# EAGLE design hestiapiUS (EAGLE 9.4.2)
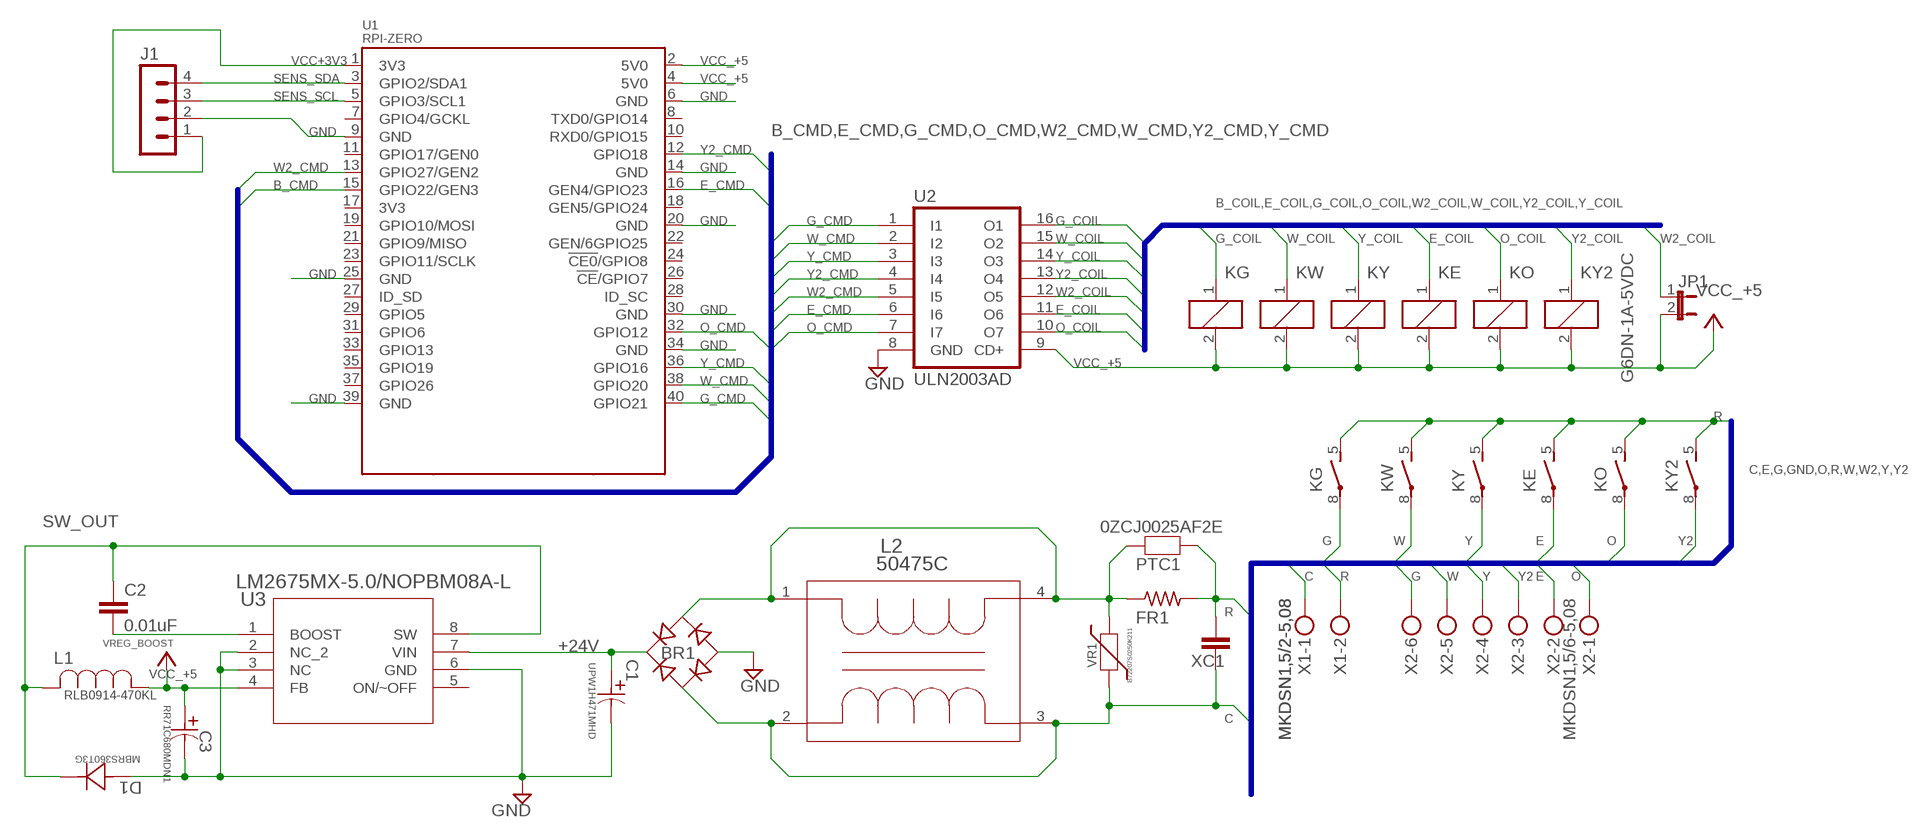
[diagram p0: schematic, sheet 1]

## Parts
BR1  DF06S  [DFS]
C1  UPW1H471MHD  [PCAP_12_5X20-THRU-ELECT]
C2  0.01uF  0.01UF-0603-25V-(+80/-20%)  [0603]
C3  RR71C680MDN1  [RR-A]
D1  MBRS360T3G  [DIODE_SMC_7P15X6P25]
FR1  R-US_0207/12  [0207/12]
J1  MA04-1  [MA04-1]
JP1  JP1E  [JP1]
KE  G6DN-1A-5VDC  [G6DN]
KG  G6DN-1A-5VDC  [G6DN]
KO  G6DN-1A-5VDC  [G6DN]
KW  G6DN-1A-5VDC  [G6DN]
KY  G6DN-1A-5VDC  [G6DN]
KY2  G6DN-1A-5VDC  [G6DN]
L1  RLB0914-470KL  [IND_BOURNS_RLB0914]
L2  50475C  [IND_50XXXC]
PTC1  0ZCJ0025AF2E  [0ZCJ]
U1  RPI-ZERO  [RASPBERRYPI_BASTELSTUBE_V13_RASPI_BOARD_B+_FULL]
U2  ULN2003AD  [SO16]
U3  LM2675MX-5.0/NOPBM08A-L  [M08A-L]
VR1  B72207S0250K211  [VARISTOR7MM]
X1  MKDSN1,5/2-5,08  [MKDSN1,5/2-5,08]
X2  MKDSN1,5/6-5,08  [MKDSN1,5/6-5,08]
XC1  C-EU025-024X044  [C025-024X044]

## Nets
+24_FUSED: BR1.AC2 FR1.1 L2.1 L2.4 PTC1.1 VR1.2
+24V: BR1.+ C1.1 U3.7(VIN)
B_CMD: U1.15(GPIO22/GEN3)
C: BR1.AC1 L2.2 L2.3 VR1.1 X1.1 XC1.2
E: KE.8(2:P) X2.2
E_CMD: U1.16(GEN4/GPIO23) U2.6(I6)
E_COIL: KE.1 U2.11(O6)
G: KG.8(2:P) X2.6
G_CMD: U1.40(GPIO21) U2.1(I1)
G_COIL: KG.1 U2.16(O1)
GND: BR1.- C1.2 C3.2 D1.2 J1.2 U1.6(GND) U1.9(GND) U1.14(GND) U1.20(GND) U1.25(GND) U1.30(GND) U1.34(GND) U1.39(GND) U2.8(GND) U3.2(NC_2) U3.3(NC) U3.6(GND)
O: KO.8(2:P) X2.1
O_CMD: U1.32(GPIO12) U2.7(I7)
O_COIL: KO.1 U2.10(O7)
R: FR1.2 KE.5(2:S) KG.5(2:S) KO.5(2:S) KW.5(2:S) KY2.5(2:S) KY.5(2:S) PTC1.2 X1.2 XC1.1
SENS_SCL: J1.3 U1.5(GPIO3/SCL1)
SENS_SDA: J1.4 U1.3(GPIO2/SDA1)
SW_OUT: C2.1 D1.1 L1.2 U3.8(SW)
VCC+3V3: J1.1 U1.1(3V3)
VCC_+5: C3.1 JP1.2 KE.2 KG.2 KO.2 KW.2 KY2.2 KY.2 L1.1 U1.2(5V0) U1.4(5V0) U2.9(CD+) U3.4(FB) ; supply symbol labelled VCC
VREG_BOOST: C2.2 U3.1(BOOST)
W: KW.8(2:P) X2.5
W2_CMD: U1.13(GPIO27/GEN2) U2.5(I5)
W2_COIL: JP1.1 U2.12(O5)
W_CMD: U1.38(GPIO20) U2.2(I2)
W_COIL: KW.1 U2.15(O2)
Y: KY.8(2:P) X2.4
Y2: KY2.8(2:P) X2.3
Y2_CMD: U1.12(GPIO18) U2.4(I4)
Y2_COIL: KY2.1 U2.13(O4)
Y_CMD: U1.36(GPIO16) U2.3(I3)
Y_COIL: KY.1 U2.14(O3)
Unconnected: U1.7(GPIO4/GCKL) U1.8(TXD0/GPIO14) U1.10(RXD0/GPIO15) U1.11(GPIO17/GEN0) U1.17(3V3) U1.18(GEN5/GPIO24) U1.19(GPIO10/MOSI) U1.21(GPIO9/MISO) U1.22(GEN/6GPIO25) U1.23(GPIO11/SCLK) U1.24(!CE0!/GPIO8) U1.26(!CE!/GPIO7) U1.27(ID_SD) U1.28(ID_SC) U1.29(GPIO5) U1.31(GPIO6) U1.33(GPIO13) U1.35(GPIO19) U1.37(GPIO26) U3.5(ON/~OFF)

## Buses
B_CMD,E_CMD,G_CMD,O_CMD,W2_CMD,W_CMD,Y2_CMD,Y_CMD
B_COIL,E_COIL,G_COIL,O_COIL,W2_COIL,W_COIL,Y2_COIL,Y_COIL
C,E,G,GND,O,R,W,W2,Y,Y2

## Library data of the parts
BR1 = hestiapiUS:DF*S: Surface Mount Glass Passivated Bridge Rectifiers Source: Source: Comchip Bridge Rectifiers DF005S-G thru DF10S-G.pdf
C1 = hestiapiUS:UPW1H471MHD; MANUFACTURER_PART_NUMBER: UPW1H471MHD; VENDOR: Nichicon
C2 = hestiapiUS:0.01UF: 0.1µF ceramic capacitors A capacitor is a passive two-terminal electrical component used to store electrical energy temporarily in an electric field.; PROD_ID: CAP-00810
C3 = hestiapiUS:RR71C680MDN1; MANUFACTURER_PART_NUMBER: RR71C680MDN1; VENDOR: Nichicon
D1 = hestiapiUS:MBRS360T3G; MANUFACTURER_PART_NUMBER: MBRS360T3G; VENDOR: ON Semiconductor
FR1 = rcl:R-US_: RESISTOR, American symbol; SPICEPREFIX: R
J1 = hestiapiUS:MA04-1: PIN HEADER; OC_FARNELL: unknown; OC_NEWARK: unknown
JP1 = hestiapiUS:JP1E: JUMPER
KE KG KO KW KY KY2 = hestiapiUS:G6DN?*: OMRON Slim, Miniature PCB Relay 20 × 5.08 × 12.5 mm Source: https://omronfs.omron.com/en_US/ecb/products/pdf/en-g6dn.pdf; OC_FARNELL: 9812660; OC_NEWARK: unknown
L1 = hestiapiUS:RLB0914-470KL; MANUFACTURER_PART_NUMBER: RLB0914470KL; VENDOR: Bourns Electronics
L2 = hestiapiUS:50475C; MANUFACTURER_PART_NUMBER: 50475C; VENDOR: Murata
PTC1 = hestiapiUS:0ZCJ0025AF2E; MANUFACTURER_PART_NUMBER: 0ZCJ0025AF2E; VENDOR: Belfuse
U1 = hestiapiUS:RPI-ZERO
U2 = hestiapiUS:ULN2003A: DRIVER ARRAY
U3 = hestiapiUS:LM2675MX-5.0/NOPB; MANUFACTURER_PART_NUMBER: LM2675MX5.0NOPB; VENDOR: Texas Instruments
VR1 = hestiapiUS:B72207S0250K211: VARISTOR 39V 250A DISC 7MM Datasheet: B72207S0250K211 <https://product.tdk.com/info/en/documents/data_sheet/70/db/var/SIOV_Leaded_StandarD.pdf>
X1 = hestiapiUS:MKDSN1,5/2-5,08: MKDSN 1,5/ 2-5,08 Printklemme Nennstrom: 13,5 A Nennspannung: 250 V Rastermaß: 5,08 mm Polzahl: 2 Anschlussart: Schraubanschluss Montage: Löten Anschlussrichtung Leiter/Platine: 0 ° Artikelnummer: 1729128 Source: http://eshop.phoenixcontact.com .. 1729128.pdf
X2 = hestiapiUS:MKDSN1,5/6-5,08: MKDSN 1,5/ 6-5,08 Printklemme Nennstrom: 13,5 A Nennspannung: 250 V Rastermaß: 5,08 mm Polzahl: 6 Anschlussart: Schraubanschluss Montage: Löten Anschlussrichtung Leiter/Platine: 0 ° Artikelnummer: 1729160 Source: http://eshop.phoenixcontact.com .. 1729160.pdf
XC1 = rcl:C-EU: CAPACITOR, European symbol; SPICEPREFIX: C

## Board
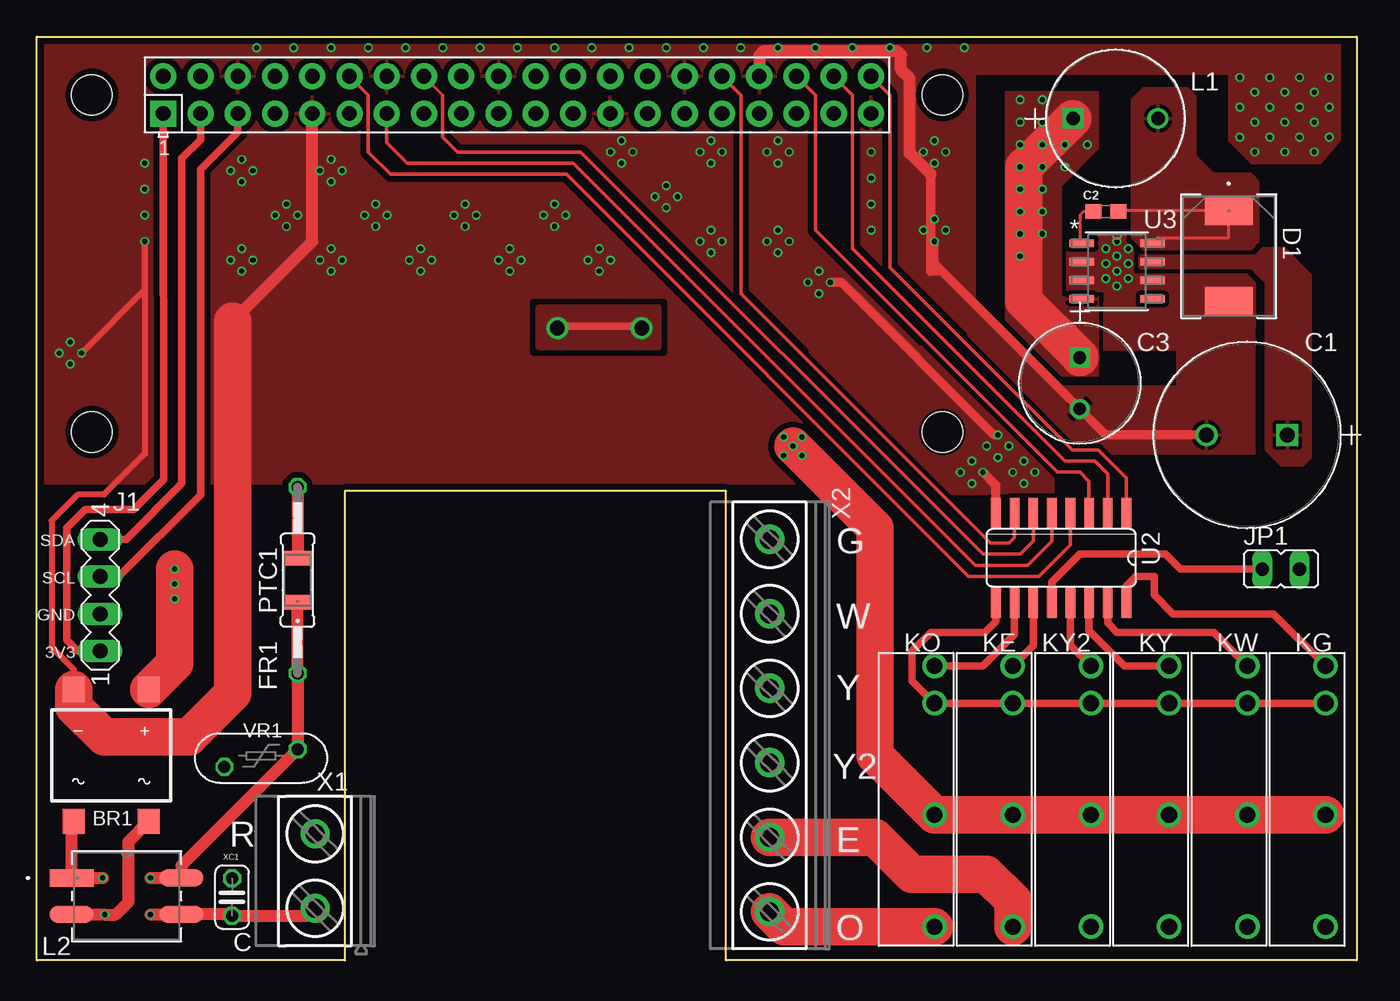
[diagram p1: board, top side]
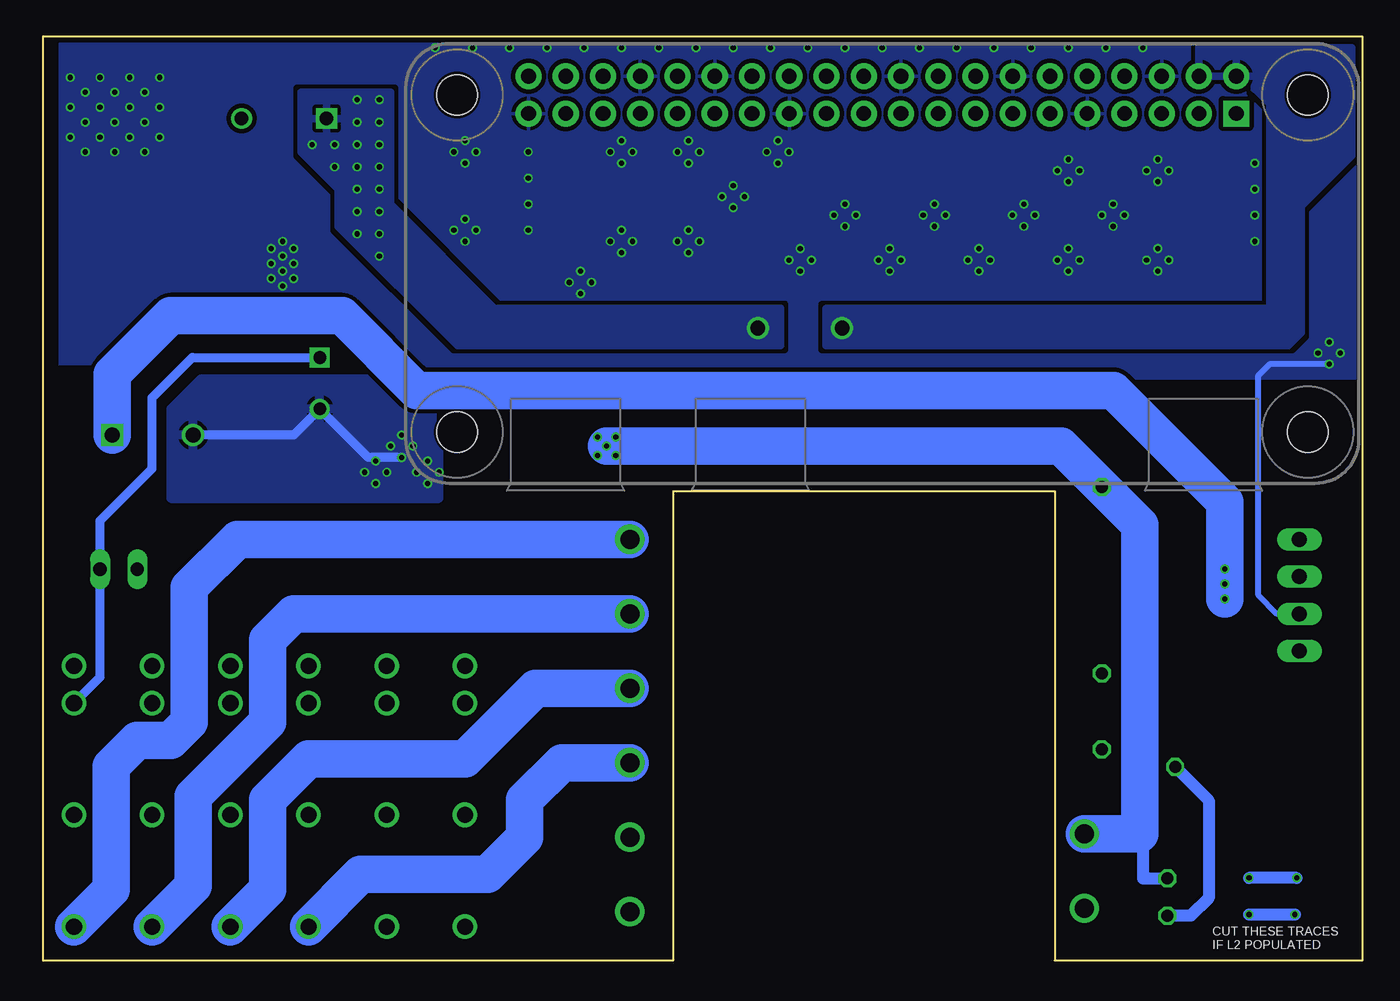
[diagram p2: board, bottom side, seen from below]

Size 90 x 63 mm. Coordinates in mm from the lower left corner, seen from the top.
Outline: 0,63 90,63 90,0 47,0 47,32 21,32 21,0 0,0 0,63
Copper layers (1*16): Top 0.035mm / dielectric 1.5mm / Bottom 0.035mm
Design rules "hestiapi": minimum track width 8mil, minimum drill 0.3mm, track to track 12mil, track to pad 10mil, pad to pad 12mil, via to via 12mil, smd to smd 6mil, copper to edge 0.2mm, drill to drill 10mil, minimum pad ring 6mil, minimum via ring 5mil, stop-mask expansion 4mil, vias tented up to drill 0mil, thermal gap 10mil

### Footprints (pad centres in the part's own frame; a part is rotated, then mirrored left to right if it is on the bottom)
DFS = smd 1.5 x 1.7: + -2.55,-4.5; - 2.55,-4.5; AC1 -2.55,4.5; AC2 2.55,4.5
PCAP_12_5X20-THRU-ELECT = drill 1.016 pad 1.524 square: 1 -5.512,0 | drill 1.016 pad 1.524: 2 0,0
0603 = smd 1.1 x 1: 1 -0.85,0; 2 0.85,0
RR-A = drill 0.864 pad 1.372 square: 1 -3.505,0 | drill 0.864 pad 1.372: 2 0,0
DIODE_SMC_7P15X6P25 = smd 1.956 x 3.251: 1 -3.099,0; 2 3.099,0
0207/12 = drill 0.813 octagon: 1 -6.35,0; 2 6.35,0
MA04-1 = drill 1.016 long: 1 -3.81,0; 2 -1.27,0; 3 1.27,0; 4 3.81,0
JP1 = drill 0.914 long: 1 0,-1.27; 2 0,1.27
G6DN = drill 1.1 pad 1.676: 1 -9.144,1.27; 2 -6.604,1.27; 5 1.016,1.27; 8 8.636,1.27
IND_BOURNS_RLB0914 = drill 0.914 pad 1.422 square: 1 -5.791,0 | drill 0.914 pad 1.422: 2 0,0
IND_50XXXC = smd 2.997 x 1.194: 1 -3.747,1.245; 2 -3.747,-1.245; 3 3.747,-1.245; 4 3.747,1.245
0ZCJ = smd 0.991 x 1.905: 1 -1.499,0; 2 1.499,0
RASPBERRYPI_BASTELSTUBE_V13_RASPI_BOARD_B+_FULL = drill 1 pad 1.778 square: 1 8.37,25.23 | drill 1 pad 1.778: 2 8.37,27.77; 3 10.91,25.23; 4 10.91,27.77; 5 13.45,25.23; 6 13.45,27.77; 7 15.99,25.23; 8 15.99,27.77; 9 18.53,25.23; 10 18.53,27.77; 11 21.07,25.23; 12 21.07,27.77; 13 23.61,25.23; 14 23.61,27.77; 15 26.15,25.23; 16 26.15,27.77; 17 28.69,25.23; 18 28.69,27.77; 19 31.23,25.23; 20 31.23,27.77; 21 33.77,25.23; 22 33.77,27.77; 23 36.31,25.23; 24 36.31,27.77; 25 38.85,25.23; 26 38.85,27.77; 27 41.39,25.23; 28 41.39,27.77; 29 43.93,25.23; 30 43.93,27.77; 31 46.47,25.23; 32 46.47,27.77; 33 49.01,25.23; 34 49.01,27.77; 35 51.55,25.23; 36 51.55,27.77; 37 54.09,25.23; 38 54.09,27.77; 39 56.63,25.23; 40 56.63,27.77 | hole 2.75: 3.5,3.5; 3.5,26.5; 61.5,3.5; 61.5,26.5
SO16 = smd 0.66 x 2.032: 1 -4.445,-3.073; 2 -3.175,-3.073; 3 -1.905,-3.073; 4 -0.635,-3.073; 5 0.635,-3.073; 6 1.905,-3.073; 7 3.175,-3.073; 8 4.445,-3.073; 9 4.445,3.073; 10 3.175,3.073; 11 1.905,3.073; 12 0.635,3.073; 13 -0.635,3.073; 14 -1.905,3.073; 15 -3.175,3.073; 16 -4.445,3.073
M08A-L = smd 1.676 x 0.508: 1 -2.413,1.905; 2 -2.413,0.635; 3 -2.413,-0.635; 4 -2.413,-1.905; 5 2.413,-1.905; 6 2.413,-0.635; 7 2.413,0.635; 8 2.413,1.905
VARISTOR7MM = drill 0.813 octagon: 1 0,0; 2 5,1.2
MKDSN1,5/2-5,08 = drill 1.3 pad 2: 1 -2.561,0.025; 2 2.519,0.025
MKDSN1,5/6-5,08 = drill 1.3 pad 2: 1 -12.7,0.025; 2 -7.62,0.025; 3 -2.54,0.025; 4 2.54,0.025; 5 7.62,0.025; 6 12.7,0.025
C025-024X044 = drill 0.813 octagon: 1 -1.27,0; 2 1.27,0

### Placement (x,y rotation side)
BR1  5.08,13.97 180 top
C1  79.76,35.83 180 top
C2  72.9,51.07 180 top
C3  71.12,37.61 270 top
D1  81.28,48.02 270 top
FR1  17.78,25.93 90 top
J1  4.32,24.91 90 top
JP1  84.84,26.69 270 top
KE  65.28,10.94 270 top
KG  86.61,10.94 270 top
KO  59.94,10.94 270 top
KW  81.28,10.94 270 top
KY  75.95,10.94 270 top
KY2  70.61,10.94 270 top
L1  76.45,57.42 0 top
L2  6.12,4.38 0 top
PTC1  17.78,25.93 90 top
U1  0.25,32.53 0 top
U2  69.85,27.45 180 top
U3  73.66,47.01 0 top
VR1  12.79,13.2 0 top
X1  19,6.11 90 top
X2  50,16.02 90 top
XC1  13.31,4.32 270 top

### Tracks (layer width: path | path; a pad name or v marks a point on that pad's centre or on a via)
+24_FUSED  (via drill 0.35)
  Top 0.813: PTC1.1 FR1.1 17.79,19.57 VR1.2 9.87,6.48 L2.4 v7.75,5.62 | BR1.AC2 2.38,9.32 L2.1 v4.5,5.62
  Bottom 0.813: v4.5,5.62 v7.75,5.62
+24V  (via drill 0.35)
  Top 2.54: v9.4,24.66 v9.4,26.68 | BR1.+ 9.4,20.24 v9.4,25.67
  Bottom 2.54: C1.1 85.27,39.97 81.28,43.96 69.6,43.96 64.52,38.88 17.02,38.88 9.4,31.26 v9.4,25.67 | v9.4,26.68 v9.4,25.67 | v9.4,24.66 v9.4,25.67
  pour Top (rank 2): 75.18,48.02 75.18,47.26 82.8,47.26 83.31,46.75 83.82,46.25 83.82,34.82 84.84,33.8 85.6,33.8 86.36,33.8 86.87,34.31 86.87,46.75 85.09,48.53 75.69,48.53
C  (via drill 0.35)
  Top 0.813: X1.1 18.47,3.05 XC1.2 13.23,3.13 L2.3 v7.75,3.12 | BR1.AC1 6.25,8.1 6.25,4 5.38,3.12 v4.62,3.12 v4.62,3.13 L2.2
  Bottom 0.813: VR1.1 10.5,10.91 10.5,4.25 11.7,3.05 XC1.2 | v4.62,3.12 v7.75,3.12
E
  Top 2.54: X2.2 57.15,8.4 59.69,5.86 64.77,5.86 66.55,4.08 KE.8
E_CMD
  Top 0.203: 27.69,59.02 U1.16
  Top 0.229: U2.6 67.94,28.59 67.06,27.7 64.52,27.7 37.08,55.14 28.7,55.14 27.69,56.15 27.69,59 27.69,59.02
E_COIL
  Top 0.508: U2.11 67.94,21.48 KE.1
G
  Bottom 2.54: KG.8 85.34,4.84 85.34,13.23 83.57,15 81.28,15 80.01,16.27 80.01,25.42 76.71,28.72 X2.6
G_CMD
  Top 0.229: U1.40 58.17,59.02 58.17,47.26 70.61,34.82 72.39,34.82 74.3,32.91 U2.1
G_COIL
  Top 0.508: KG.1 84.33,23.64 77.47,23.64 76.2,24.91 76.2,26.18 74.93,26.18 74.3,25.55 U2.16
GND  (via drill 0.35)
  Top 0.406: v3.05,41.42 7.37,45.74 v7.37,49.04 7.37,34.56 4.57,31.77 2.79,31.77 1.02,29.99 1.02,21.35 2.53,19.84 BR1.-
  Top 0.61: C3.2 61.72,47.01 60.96,47.01 60.96,53.61 | U2.8 65.41,32.4 v64.52,33.29 | C1.2 72.9,35.83 C3.2 | C3.2 61.21,47.52 v61.21,49.04 | v65.53,35.83 65.28,35.83 54.86,46.25 v54.1,46.25
  Top 0.813: 13.35,43.59 18.78,49.03 U1.9 | 60.96,53.61 59.53,55.04 59.53,60.13 58.93,60.73 58.93,61.74 58.67,61.99 49.53,61.99 49.26,61.73 U1.34
  Top 2.54: BR1.- 2.53,17.3 4.59,15.23 10.39,15.23 13.35,18.19 13.35,43.59
  Bottom 0.406: J1.2 5.84,23.64 7.11,24.91 7.11,39.9 6.35,40.66 v2.29,40.66
  Bottom 0.61: v65.53,34.31 67.82,34.31 C3.2 72.9,35.83 C1.2
  other vias: 7.37,52.6 16.26,50.82 17.02,50.06 17.53,62.25 14.99,62.25 17.78,50.82 7.37,50.82 17.02,51.58 7.37,54.37 50.55,55.9 49.78,55.14 51.31,55.14 50.55,54.37 13.97,53.1 13.21,53.87 14.73,53.87 13.97,54.63 13.97,47.01 13.21,47.77 14.73,47.77 13.97,48.53 20.07,53.1 19.3,53.87 20.83,53.87 20.07,54.63 20.07,47.01 19.3,47.77 20.83,47.77 20.07,48.53 25.4,47.77 26.16,47.01 26.92,47.77 26.16,48.53 23.11,50.06 22.35,50.82 23.88,50.82 23.11,51.58 29.21,50.06 28.45,50.82 29.97,50.82 29.21,51.58 42.16,52.09 42.93,51.33 43.69,52.09 42.93,52.85 39.88,54.37 39.12,55.14 40.64,55.14 39.88,55.9 45.97,54.37 45.21,55.14 46.74,55.14 45.97,55.9 45.21,49.04 45.97,48.28 46.74,49.04 45.97,49.8 52.58,46.25 53.34,45.48 53.34,47.01 50.55,48.28 49.78,49.04 51.31,49.04 50.55,49.8 32.26,47.01 31.5,47.77 33.02,47.77 32.26,48.53 37.59,47.77 38.35,47.01 39.12,47.77 38.35,48.53 35.31,50.06 34.54,50.82 36.07,50.82 35.31,51.58 60.71,62.25 63.25,62.25 58.17,62.25 55.63,62.25 50.55,62.25 53.09,62.25 48.01,62.25 45.47,62.25 40.39,62.25 42.93,62.25 37.85,62.25 35.31,62.25 30.23,62.25 32.77,62.25 27.69,62.25 25.15,62.25 20.07,62.25 22.61,62.25 61.21,50.56 60.45,49.8 61.98,49.8 63.75,32.53 62.99,33.29 63.75,34.05 66.55,33.29 67.31,32.53 68.07,33.29 67.31,34.05 64.77,35.07 66.29,35.07 56.9,53.36 56.9,49.8 56.9,51.58 56.9,55.14 61.21,55.9 60.45,55.14 61.21,54.37 61.98,55.14 74.42,48.53 73.66,48.02 74.42,46.5 74.42,47.52 73.66,49.04 73.66,47.01 72.9,48.53 72.9,46.5 72.9,47.52 73.66,45.99 84.07,60.22 83.06,57.17 84.07,56.15 83.06,59.2 82.04,58.18 82.04,56.15 82.04,60.22 86.11,56.15 85.09,59.2 84.07,58.18 88.14,60.22 88.14,58.18 86.11,58.18 87.12,55.14 87.12,57.17 87.12,59.2 88.14,56.15 86.11,60.22 83.06,55.14 85.09,57.17 85.09,55.14 1.52,41.42 2.29,42.18
  pour Top (rank 3): 68.83,34.56 83.06,34.56 83.06,46.25 81.03,48.28 70.36,48.28 70.36,41.67 77.72,41.67 77.72,39.13 68.83,39.13
  pour Top (isolate 0.406, rank 5): 0.51,62.76 0.51,32.52 64.01,32.52 64.01,60.47 81.28,60.47 81.28,55.9 82.8,54.37 87.56,54.37 88.9,55.94 88.9,62.76
  pour Bottom (rank 5): 0.51,62.5 0.51,39.64 64.01,39.64 64.01,62.5
  pour Top: 63.75,42.69 70.87,35.58 72.9,35.58 72.9,38.63 72.64,38.88 69.34,38.88 62.74,45.48 62.23,45.99
  pour Top: 60.2,41.67 69.09,32.78 69.09,32.02 62.48,32.02 52.83,41.67
  pour Bottom (rank 6): 81.28,37.61 81.28,31.51 62.99,31.51 62.99,37.36 65.28,39.64 79.25,39.64
  pour Top (rank 6): 83.06,48.53 83.06,43.2 69.34,43.2 69.34,48.53 72.39,48.53 72.39,49.55 75.44,49.55 75.44,48.53
  pour Bottom (rank 6): 88.9,62.5 88.9,40.66 62.99,40.66 62.99,62.5
O
  Top 2.54: KO.8 50.99,2.3 X2.1
O_CMD
  Top 0.229: U2.7 66.67,28.85 66.29,28.47 65.02,28.47 48.01,45.48 48.01,59.02 U1.32
O_COIL
  Top 0.508: KO.1 64.52,20.08 66.67,22.24 U2.10
R  (via drill 0.35)
  Top 0.203: v52.19,34.45 v51.56,35.07 | v50.94,35.7 v51.56,35.07 | v52.19,35.7 v51.56,35.07 | v50.94,34.45 v51.56,35.07
  Top 0.813: FR1.2 PTC1.2
  Top 2.54: KG.5 KW.5 KY.5 KY2.5 KE.5 KO.5 57.15,13.99 57.15,29.48 v51.56,35.07
  Bottom 0.813: XC1.1 14.96,5.59 14.96,8.39 15.21,8.63
  Bottom 2.54: v51.56,35.07 20.57,35.07 FR1.2 15.21,29.7 15.21,8.63 X1.2
SENS_SCL
  Top 0.508: U1.5 13.7,56.49 11.16,53.95 11.16,31.76 5.59,26.18 J1.3
SENS_SDA
  Top 0.508: U1.3 11.16,55.98 9.89,54.71 9.89,32.52 6.1,28.72 J1.4
SW_OUT
  Top 0.203: C2.1 73.8,51.12 D1.1 81.28,49.29 76.45,49.29 U3.8
  pour Top: 75.44,48.53 82.8,48.53 83.31,49.04 83.31,53.1 82.8,53.61 80.26,53.61 79.25,54.63 78.99,54.88 78.99,58.95 78.49,59.45 75.44,59.45 74.68,58.69 74.68,49.8 74.68,49.29
VCC+3V3
  Top 0.508: J1.1 2.79,21.1 2.03,21.86 2.03,29.48 3.3,30.75 6.6,30.75 8.64,32.79 U1.1
VCC_+5  (via drill 0.35, 1)
  Top 0.508: U2.9 65.41,23.11 64.67,22.37 60.96,22.37 59.69,21.1 59.69,19.07 KO.2 KE.2 KY2.2 KY.2 KW.2 KG.2 | v35.5,43.12 35.62,43.25 41.12,43.25 v41.25,43.12
  Top 2.54: C3.1 71.12,41.17 67.31,44.98 67.31,54.12 67.36,54.12 L1.1
  Bottom 0.61: KG.2 86.11,19.32 JP1.2 86.11,29.99 82.55,33.55 82.55,38.37 79.81,41.12 C3.1
  other vias: 67.06,57.17 68.58,57.17 67.06,55.64 67.06,54.12 67.06,51.07 68.58,51.07 67.06,58.69 70.1,54.12 68.58,49.55 67.06,48.02 67.06,52.6 68.58,54.12 67.06,49.55 68.58,52.6 68.58,55.64 70.1,55.64 71.63,55.64 68.58,58.69
  pour Top: 72.39,45.23 69.85,45.23 69.85,52.85 72.39,55.39 72.39,59.2 66.04,59.2 66.04,43.71 69.85,39.9 72.39,39.9
  pour Bottom: 42.12,44.47 59.18,44.47 66.29,51.58 66.29,59.2 72.39,59.2 72.39,55.14 69.85,52.6 69.85,50.06 61.72,41.93 39.7,41.93 39.7,44.49
  pour Bottom: 11.18,62.25 11.18,60.22 8.13,60.22 6.35,58.44 6.35,44.47 36.6,44.47 36.6,41.93 5.08,41.93 4.19,42.82 4.19,51.45 0.76,54.88 0.76,62.25
  pour Top: 34.25,44.5 42.38,44.5 42.38,41.88 34.25,41.88
VREG_BOOST
  Top 0.203: C2.2 71.37,51.07 71.12,50.82 71.12,49.04 U3.1
W
  Bottom 2.54: KW.8 79.76,5.1 79.76,11.19 74.68,16.27 74.68,21.86 72.9,23.64 X2.5
W2_CMD
  Top 0.203: 23.85,56.89 23.85,57.75 U1.13
  Top 0.229: U2.5 69.22,28.59 67.56,26.94 64.01,26.94 36.58,54.37 25.25,54.37 23.85,55.77 23.85,56.89
W2_COIL
  Top 0.508: U2.12 69.22,25.8 71.12,27.7 76.96,27.7 77.98,26.69 JP1.1
W_CMD
  Top 0.229: U2.2 73.03,33.16 72.14,34.05 70.1,34.05 55.63,48.53 55.63,59.02 U1.38
W_COIL
  Top 0.508: U2.15 73.03,23.01 73.66,22.37 80.26,22.37 KW.1
Y
  Bottom 2.54: KY.8 74.68,4.84 74.68,10.94 71.88,13.73 61.21,13.73 56.39,18.56 X2.4
Y2
  Bottom 2.54: X2.3 54.61,13.48 57.15,10.94 57.15,8.4 59.69,5.86 68.33,5.86 KY2.8
Y2_CMD
  Top 0.229: U1.12 22.61,59.02 22.61,55.14 24.13,53.61 36.11,53.61 63.54,26.18 68.33,26.18 70.48,28.34 U2.4
Y2_COIL
  Top 0.508: KY2.1 70.48,21.48 U2.13
Y_CMD
  Top 0.229: U2.3 71.75,32.66 71.12,33.29 69.6,33.29 53.09,49.8 53.09,59.02 U1.36
Y_COIL
  Top 0.508: U2.14 71.75,22.5 74.17,20.08 KY.1

### Text on the board
tNames: G | W | SDA / / SCL / / GND / / 3V3 | Y | Y2 | R | E | C | O
bNames: CUT THESE TRACES / IF L2 POPULATED
tValues: OUTPUT: 5V 1.0A | HestiaPi 24vac v1.1 / oddbondboris 9-17-2019 | INPUT: 24VAC / 28VAC MAX / MAXIMUM PEAK / VOLTAGE 40VDC | Populate either FR1 or PTC1